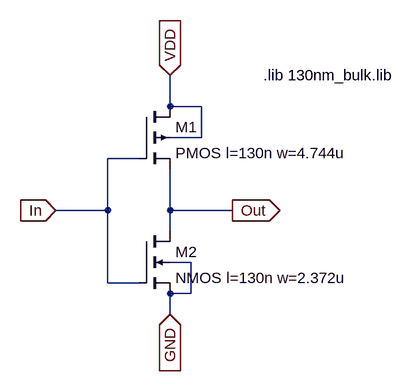
[diagram p0: schematic Inverter_B.asc]
Inverter_B.asc, the LTspice schematic file:
Version 4
SHEET 1 880 680
WIRE 224 64 224 16
WIRE 272 64 224 64
WIRE 272 112 272 64
WIRE 272 112 224 112
WIRE 176 144 128 144
WIRE 128 224 128 144
WIRE 128 224 48 224
WIRE 224 224 224 160
WIRE 320 224 224 224
WIRE 224 256 224 224
WIRE 256 304 224 304
WIRE 128 336 128 224
WIRE 176 336 128 336
WIRE 256 352 256 304
WIRE 256 352 224 352
WIRE 224 384 224 352
FLAG 224 16 VDD
IOPIN 224 16 In
FLAG 224 384 GND
IOPIN 224 384 In
FLAG 48 224 In
IOPIN 48 224 In
FLAG 320 224 Out
IOPIN 320 224 Out
SYMBOL pmos4 176 64 R0
SYMATTR InstName M1
SYMATTR Value2 l=130n w=4.744u
SYMATTR Value PMOS l=130n w=4.744u
SYMBOL nmos4 176 256 R0
SYMATTR InstName M2
SYMATTR Value2 l=130n w=2.372u
SYMATTR Value NMOS l=130n w=2.372u
TEXT 368 16 Left 2 !.lib 130nm_bulk.lib

The netlist it stands for:
* Inverter_B.asc
M1 VDD In Out VDD PMOS l=130n w=4.744u l=130n w=4.744u
M2 Out In GND GND NMOS l=130n w=2.372u l=130n w=2.372u
.model NMOS NMOS
.model PMOS PMOS
.lib standard.mos
.lib 130nm_bulk.lib
.backanno
.end